# Altium schematic sheet CAN_Connection.SchDoc
size A
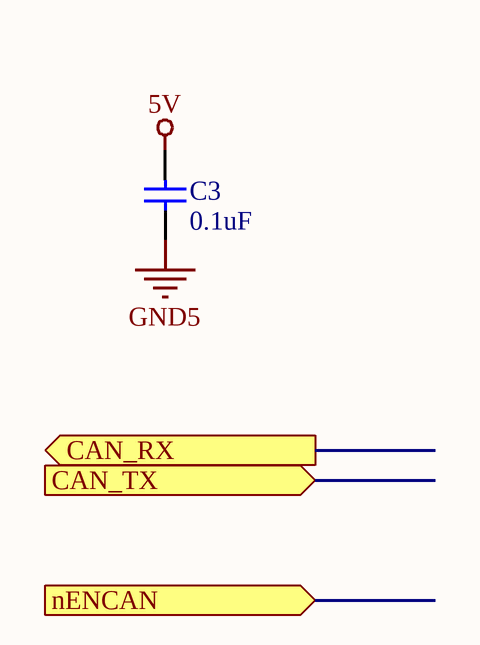
[diagram p0: CAN_Connection.SchDoc]

## Parts
C3  0.1uF  [C 0805 (2012)]

## Ports
CAN_RX (out), CAN_TX (in), nENCAN (in)

## Nets
5V: C3.1
GND5: C3.2

## Library data of the parts
C3 = Capacitor NP: Capacitor non-pol